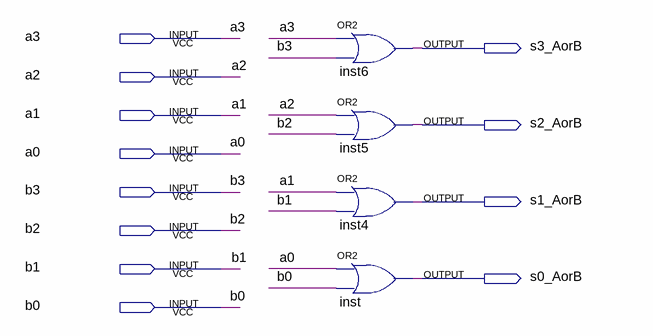
[diagram p0: schematic sheet]
// Quartus schematic AorB.bdf as structural Verilog: 4 symbols, 12 pins
module AorB (
  input  a3,
  input  a2,
  input  a1,
  input  a0,
  input  b3,
  input  b2,
  input  b1,
  input  b0,
  output s3_AorB,
  output s2_AorB,
  output s1_AorB,
  output s0_AorB
);

  or inst6 (s3_AorB, a3, b3);
  or inst5 (s2_AorB, a2, b2);
  or inst4 (s1_AorB, a1, b1);
  or inst (s0_AorB, a0, b0);
endmodule
